# Altium schematic sheet InputMicroproduct.SchDoc: Input_MicroProduct
size A; DrawnBy: Sanjith; SheetNumber: 1; SheetTotal: 2
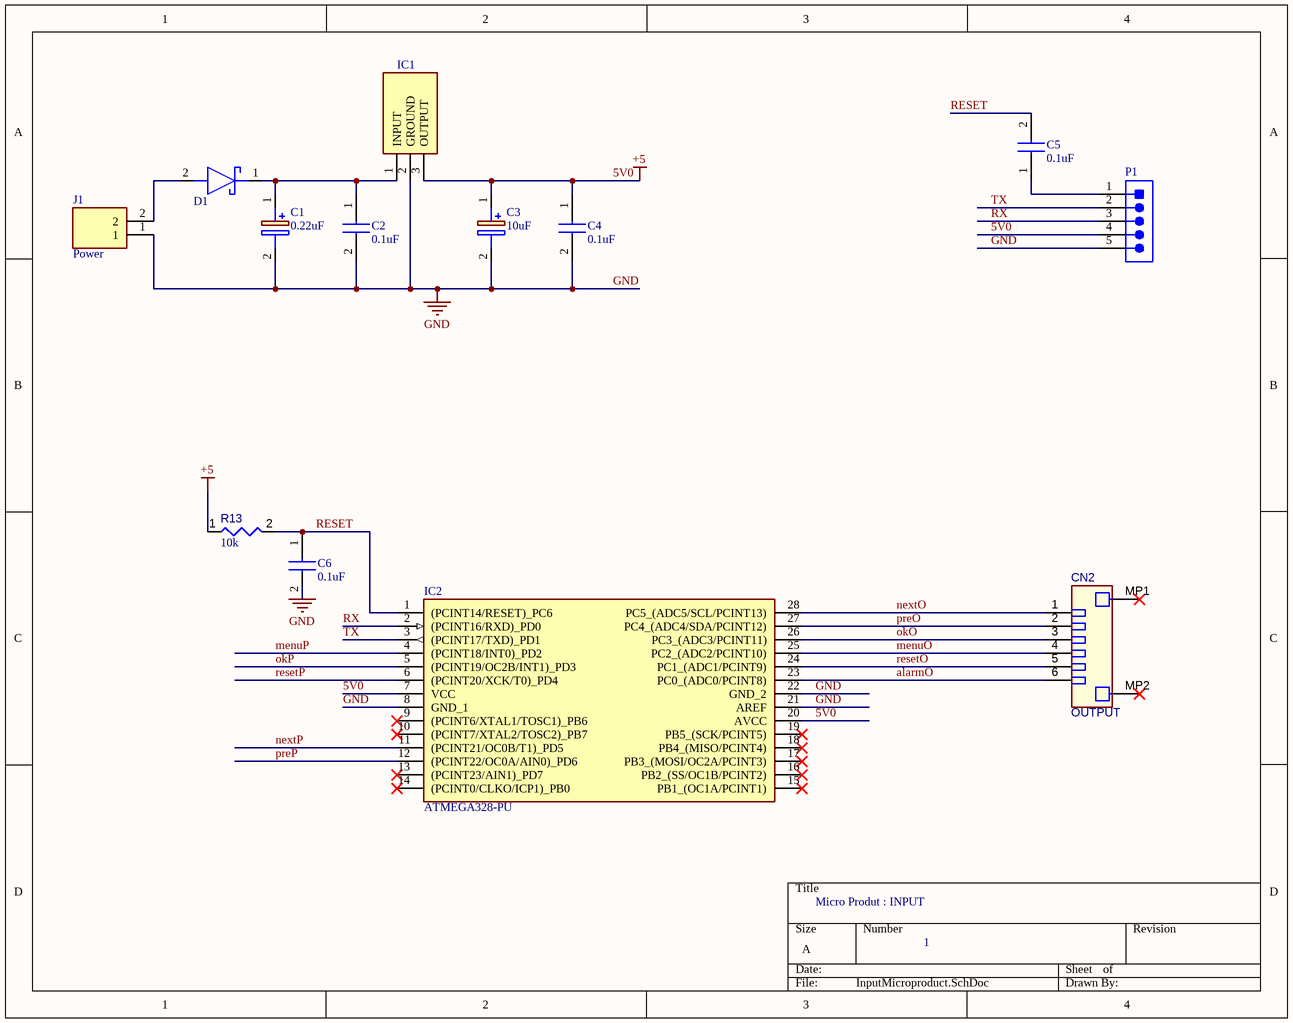
[diagram p0: InputMicroproduct.SchDoc]

## Parts
C1  0.22uF  [CAPPRD200W52D500H1250]
C2  0.1uF  [S104Z93Z5VL83L0R]
C3  10uF  [CAPPRD200W55D500H1250]
C4  0.1uF  [S104Z93Z5VL83L0R]
C5  0.1uF  [S104Z93Z5VL83L0R]
C6  0.1uF  [S104Z93Z5VL83L0R]
CN2  OUTPUT  [JST-BM06B-SRSS-TB_V]
D1  Protection Diode  [DIOAD950W60L350D150]  (value not drawn)
IC1  Power Regulator  [TO255P460X1020X2008-3P]  (value not drawn)
IC2  ATMEGA328-PU  [DIP1016W53P254L3468H457Q28N]
J1  TEXT: Power  [15462152]  (hidden comment: 1546215-2)
P1  77311-462K05LF  [FCI-77311-5_V]  (value not drawn)
R13  value 10k  [RESA60-630X240]  (hidden comment: MFR-25FBF52-10K)

## Nets
5V0: C3.1(+) C4.1 IC1.3(OUTPUT) IC2.7(VCC) IC2.20(AVCC) P1.4(VCC) R13.1  [also labelled +5]
GND: C1.2(-) C2.2 C3.2(-) C4.2 C6.2 IC1.2(GROUND) IC2.8(GND_1) IC2.21(AREF) IC2.22(GND_2) J1.1 P1.5(CTS)
alarmO: CN2.6 IC2.23(PC0_(ADC0/PCINT8))
menuO: CN2.4 IC2.25(PC2_(ADC2/PCINT10))
menuP: IC2.4((PCINT18/INT0)_PD2)
nextO: CN2.1 IC2.28(PC5_(ADC5/SCL/PCINT13))
nextP: IC2.11((PCINT21/OC0B/T1)_PD5)
okO: CN2.3 IC2.26(PC3_(ADC3/PCINT11))
okP: IC2.5((PCINT19/OC2B/INT1)_PD3)
preO: CN2.2 IC2.27(PC4_(ADC4/SDA/PCINT12))
preP: IC2.12((PCINT22/OC0A/AIN0)_PD6)
RESET: C5.2 C6.1 IC2.1((PCINT14/RESET)_PC6) R13.2
resetO: CN2.5 IC2.24(PC1_(ADC1/PCINT9))
resetP: IC2.6((PCINT20/XCK/T0)_PD4)
RX: IC2.2((PCINT16/RXD)_PD0) P1.3(TXO)
TX: IC2.3((PCINT17/TXD)_PD1) P1.2(RXI)
NetC1_1: C1.1(+) C2.1 D1.1(K) IC1.1(INPUT)
NetC5_1: C5.1 P1.1(DTR)
NetD1_2: D1.2(A) J1.2

Not connected (* = marked no-connect by the designer): CN2 MP1* MP2*; IC2 9((PCINT6/XTAL1/TOSC1)_PB6)* 10((PCINT7/XTAL2/TOSC2)_PB7)* 13((PCINT23/AIN1)_PD7)* 14((PCINT0/CLKO/ICP1)_PB0)* 15(PB1_(OC1A/PCINT1))* 16(PB2_(SS/OC1B/PCINT2))* 17(PB3_(MOSI/OC2A/PCINT3))* 18(PB4_(MISO/PCINT4))* 19(PB5_(SCK/PCINT5))*

## Notes on the sheet
- Micro Produt : INPUT
- 1

## Library data of the parts
C1 = 860010772002: Capacitor Polarised; Manufacturer_Name: Wurth Elektronik; Datasheet Link: https://componentsearchengine.com/Datasheets/1/860010772002.pdf; Height: 12.5mm; Manufacturer_Part_Number: 860010772002; Mouser Part Number: 710-860010772002; Mouser Price/Stock: https://www.mouser.co.uk/ProductDetail/Wurth-Elektronik/860010772002?qs=0KOYDY2FL2%2FXueoM4QQtRg%3D%3D; value: 0.22uF
C2 C4-C6 = S104Z93Z5VL83L0R: Capacitor; Manufacturer_Name: Vishay; Datasheet Link: http://www.vishay.com/docs/28546/s104z93z.pdf; Height: 23.6mm; Manufacturer_Part_Number: S104Z93Z5VL83L0R; Mouser Part Number: 594-S104Z93Z5VL83L0R; Mouser Price/Stock: https://www.mouser.co.uk/ProductDetail/Vishay-BC-Components/S104Z93Z5VL83L0R?qs=MZE%2F3ll%252Bp%2Fba6C%252BzoK7Jpg%3D%3D; Arrow Part Number: S104Z93Z5VL83L0R; Arrow Price/Stock: https://www.arrow.com/en/products/s104z93z5vl83l0r/vishay; value: 0.1uF
C3 = EEUFR1H100: Capacitor Polarised; Manufacturer_Name: Panasonic; Datasheet Link: https://componentsearchengine.com/Datasheets/2/EEUFR1H100.pdf; Height: 12.5mm; Manufacturer_Part_Number: EEUFR1H100; Arrow Part Number: EEUFR1H100; Arrow Price/Stock: https://www.arrow.com/en/products/eeufr1h100/panasonic; value: 10uF
CN2 = CMP-002-00052-2: Header, Pitch 1 mm, 1 x 6 Position, Height 4.25 mm, -25 to 85 degC; Connector Type: Header,Shrouded; Pins: 8
D1 = SD103A-TR: Schottky Diode; Manufacturer_Name: Vishay; Datasheet Link: https://componentsearchengine.com/Datasheets/5/SD103A-TR.pdf; Manufacturer_Part_Number: SD103A-TR; Mouser Part Number: 625-SD103A; Mouser Price/Stock: https://www.mouser.co.uk/ProductDetail/Vishay-Semiconductors/SD103A-TR?qs=RwahMLkpD2urFD%2FzZdGOBw%3D%3D; Arrow Part Number: SD103A-TR; Arrow Price/Stock: https://www.arrow.com/en/products/sd103a-tr/vishay
IC1 = L7805CV: Integrated Circuit; Manufacturer_Name: STMicroelectronics; Datasheet Link: http://www.st.com/web/en/resource/technical/document/datasheet/CD00000444.pdf; Height: 4.6mm; Manufacturer_Part_Number: L7805CV; Mouser Part Number: 511-L7805CV; Mouser Price/Stock: https://www.mouser.co.uk/ProductDetail/STMicroelectronics/L7805CV?qs=9NrABl3fj%2FqplZAHiYUxWg%3D%3D; Arrow Part Number: L7805CV; Arrow Price/Stock: https://www.arrow.com/en/products/l7805cv/stmicroelectronics
IC2 = ATMEGA328-PU: Integrated Circuit; Manufacturer_Name: Microchip; Datasheet Link: https://componentsearchengine.com/Datasheets/1/ATMEGA328-PU.pdf; Height: 4.572mm; Manufacturer_Part_Number: ATMEGA328-PU; Mouser Part Number: 556-ATMEGA328-PU; Mouser Price/Stock: https://www.mouser.co.uk/ProductDetail/Microchip-Technology-Atmel/ATMEGA328-PU?qs=lwdSMh1%2FoYJT8tfItQpQtA%3D%3D; Arrow Part Number: ATMEGA328-PU; Arrow Price/Stock: https://www.arrow.com/en/products/atmega328-pu/microchip-technology?region=europe
J1 = 1546215-2: Connector - Two pin (Power); Manufacturer_Name: TE Connectivity; Datasheet Link: https://www.te.com/commerce/DocumentDelivery/DDEController?Action=srchrtrv&DocNm=1546215&DocType=Customer+Drawing&DocLang=English; Height: 10.3mm; Manufacturer_Part_Number: 1546215-2; Mouser Part Number: 571-1546215-2; Mouser Price/Stock: https://www.mouser.co.uk/ProductDetail/TE-Connectivity/1546215-2?qs=Lxq28tKK6BPmJFoAOY7Ljw%3D%3D; Arrow Part Number: 1546215-2; Arrow Price/Stock: https://www.arrow.com/en/products/1546215-2/te-connectivity
P1 = CMP-002-00021-1: Male Header, Pitch 2.54 mm, 1 x 5 Position, Height 16.24 mm, Tail Length 3.05 mm, -65 to 125 degC, RoHS, Tape and Reel; Manufacturer: FCI Electronics; Gender: Male; Mounting Technology: TH; Connector Type: Header; Package Reference: 77311-5; Case/Package: 77311-5; RoHS Compliant: Unknown; Datasheet URL: http://portal.fciconnect.com/Comergent//fci/drawing/77311.pdf; Manufacturer URL: http://portal.fciconnect.com/; Package Description: Male Header, Pitch 2.54 mm, 1 x 5 Position, Height 16.24 mm, Tail Length 3.05 mm; Datasheet Version: Rev. CK, 07/2016
R13 = CMP-009-00047-3: Axial Resistor, 10 KOhm, +/- 1%, 0.25 W, -55 to 155 degC, 2-Pin THD, RoHS, Bulk; Manufacturer: Yageo; Power: 250mW; Voltage Rating: 250V; Package Reference: MFR-25; Datasheet Version: Apr-13; Packaging: Bulk; RoHS Compliant: True; Manufacturer URL: http://www.yageo.com/; Package Quantity: 200; Datasheet URL: http://www.yageo.com/documents/recent/Yageo%20LR_MFR_2013.pdf; Case/Package: Axial; Mounting Technology: TH; Package Description: 2-Pin Axial Lead, Dia 2.4 mm, Body Length 6.3 mm; Max Operating Temperature: 155°C; Min Operating Temperature: -55°C; Tolerance: 1%